# Altium project RCJ_OnStage2024_FC.PrjPcb
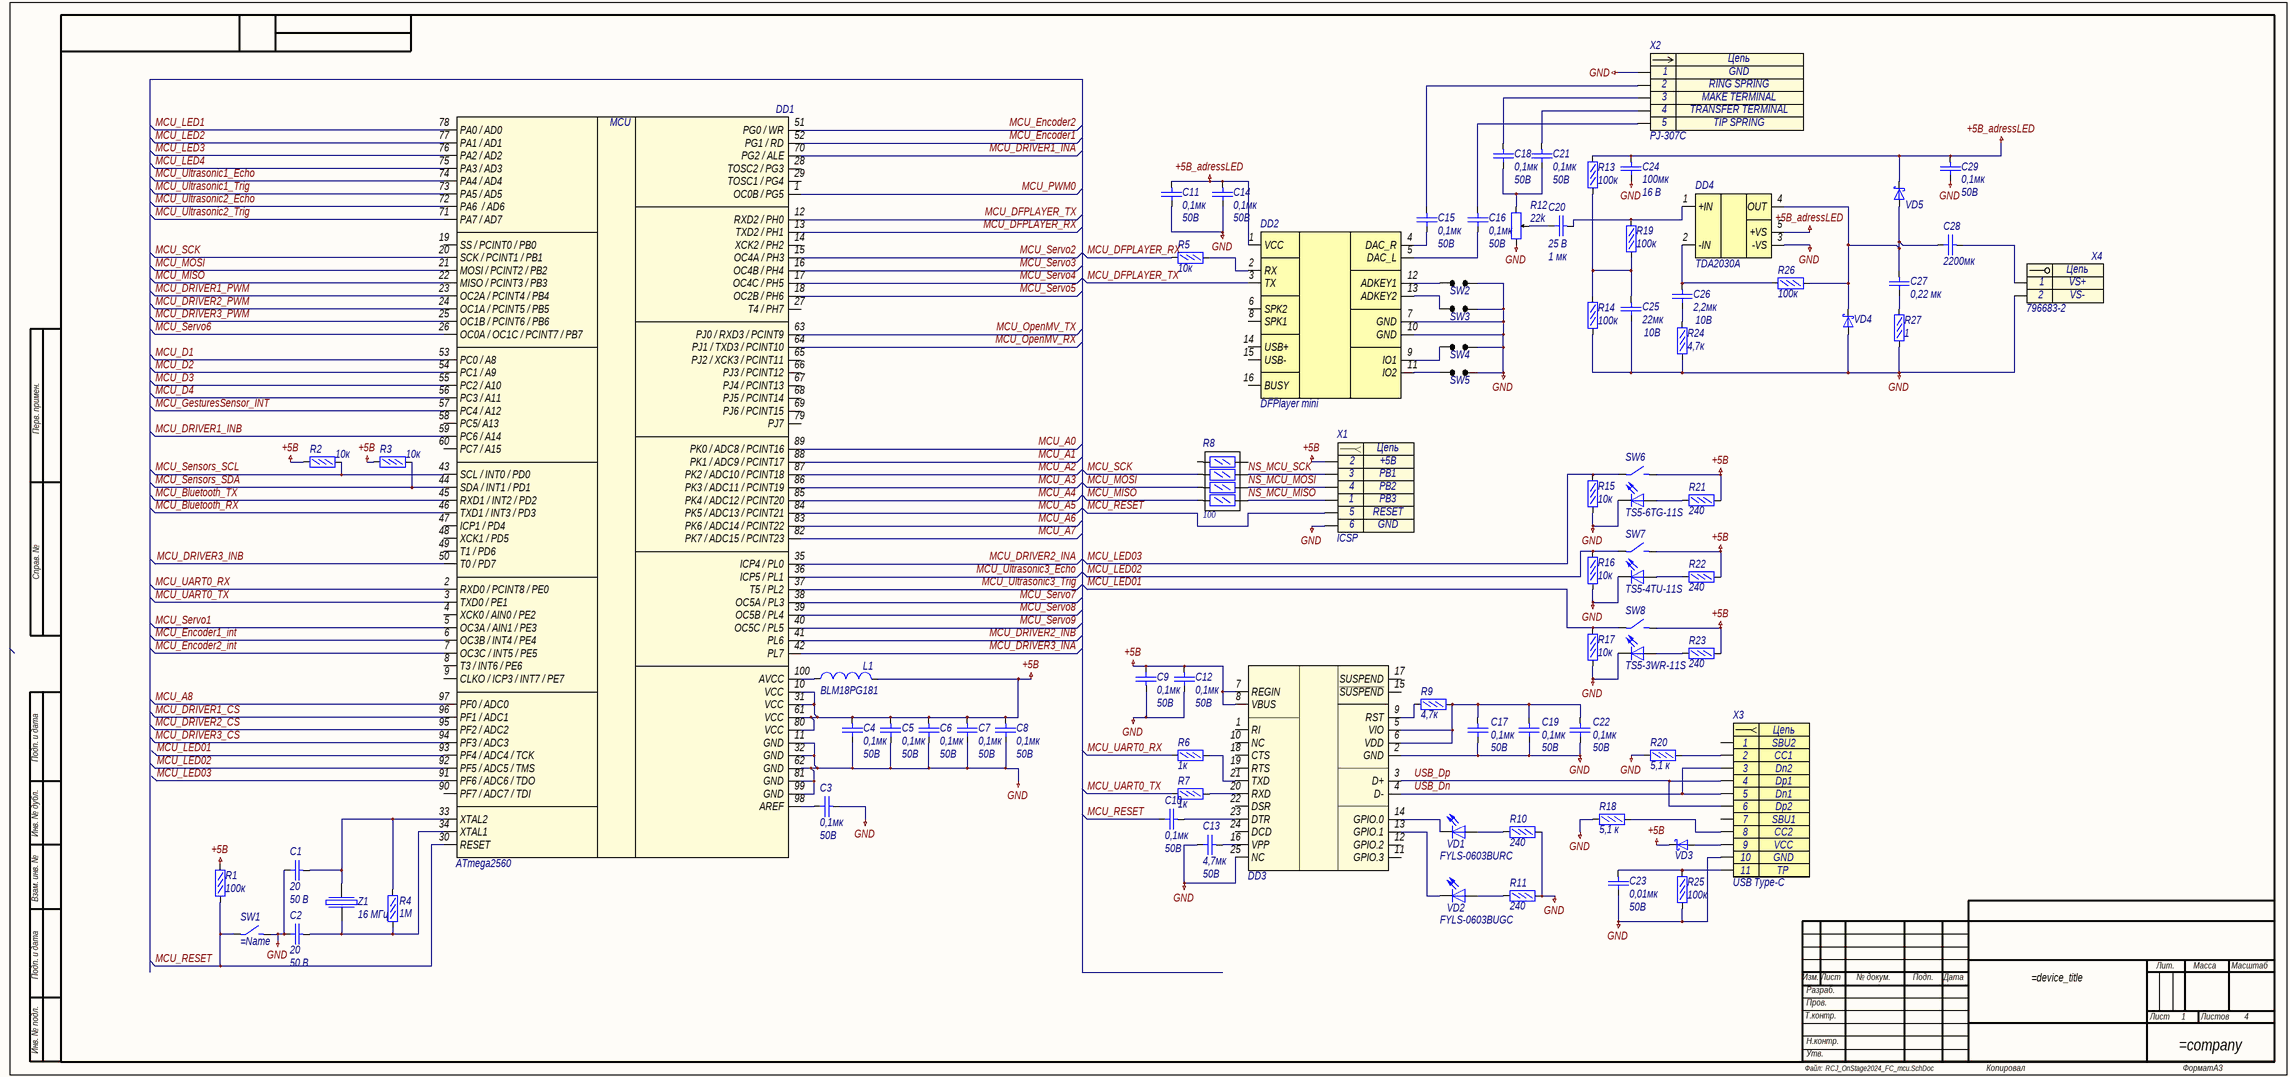
[diagram p0: RCJ_OnStage2024_FC_mcu.SchDoc]
4 sheets, 228 parts. Net scope: global (net labels, ports and power ports of the same name join across sheets).
Board file: RCJ_OnStage2024_FC.PcbDoc
Sheets:
  RCJ_OnStage2024_FC_mcu.SchDoc
  RCJ_OnStage2024_FC_drivers.SchDoc
  RCJ_OnStage2024_FC_sensors.SchDoc
  RCJ_OnStage2024_FC_pwr.SchDoc

## Sheet RCJ_OnStage2024_FC_mcu.SchDoc
size 891 x 420 mm; SheetNumber: 1; SheetTotal: 4; SheetSize: А3

### Parts
C1  20  Voltage: 50 В  [C0603]
C2  20  Voltage: 50 В  [C0603]
C3  0,1мк  Voltage: 50В  [C0603]
C4  0,1мк  Voltage: 50В  [C0603]
C5  0,1мк  Voltage: 50В  [C0603]
C6  0,1мк  Voltage: 50В  [C0603]
C7  0,1мк  Voltage: 50В  [C0603]
C8  0,1мк  Voltage: 50В  [C0603]
C9  0,1мк  Voltage: 50В  [C0603]
C10  0,1мк  Voltage: 50В  [C0603]
C11  0,1мк  Voltage: 50В  [C0603]
C12  0,1мк  Voltage: 50В  [C0603]
C13  4,7мк  Voltage: 50В  [C1210]
C14  0,1мк  Voltage: 50В  [C0603]
C15  0,1мк  Voltage: 50В  [C0603]
C16  0,1мк  Voltage: 50В  [C0603]
C17  0,1мк  Voltage: 50В  [C0603]
C18  0,1мк  Voltage: 50В  [C0603]
C19  0,1мк  Voltage: 50В  [C0603]
C20  1 мк  [C0805]
C21  0,1мк  Voltage: 50В  [C0603]
C22  0,1мк  Voltage: 50В  [C0603]
C23  0,01мк  Voltage: 50В  [C0603]
C24  100мк  Voltage: 16 В  [C1210]
C25  22мк  Voltage: 10В  [C1210]
C26  2,2мк  Voltage: 10В  [C0603]
C27  0,22 мк  [C0805]
C28  2200мк  [C0603]
C29  0,1мк  Voltage: 50В  [C0603]
DD1  ATmega2560  [LQFP100]
DD2  DFPlayer mini  [MP3-TF-16P]
DD3  CP2104  [QFN-24]  (value not drawn)
DD4  TDA2030A  [TO-220-5B]
L1  BLM18PG181  [L0603]
R1  100к  [R0603]
R2  10к  [R0603]
R3  10к  [R0603]
R4  1М  [R0603]
R5  10к  [R0603]
R6  1к  [R0603]
R7  1к  [R0603]
R8  100  [R0603x4]
R9  4,7к  [R0603]
R10  240  [R0603]
R11  240  [R0603]
R12  22k  [RM065]
R13  100к  [R0603]
R14  100к  [R0603]
R15  10к  [R0603]
R16  10к  [R0603]
R17  10к  [R0603]
R18  5,1 к  [R0603]
R19  100к  [R0603]
R20  5,1 к  [R0603]
R21  240  [R0603]
R22  240  [R0603]
R23  240  [R0603]
R24  4,7к  [R0603]
R25  100к  [R0603]
R26  100к  [R0603]
R27  1  [R0603]
SW1  (no value)  [it-1187]
SW2  (no value)  [jumper]
SW3  (no value)  [jumper]
SW4  (no value)  [jumper]
SW5  (no value)  [jumper]
SW6  TS5-6TG-11S  [TS5]
SW7  TS5-4TU-11S  [TS5]
SW8  TS5-3WR-11S  [TS5]
VD1  FYLS-0603BURC  [LED0603_RED]
VD2  FYLS-0603BUGC  [LED0603_GREEN]
VD3  MBR140SFT1G  [SOD123]  (value not drawn)
VD4  MBR140SFT1G  [SOD123]  (value not drawn)
VD5  MBR140SFT1G  [SOD123]  (value not drawn)
X1  ICSP  [PLS-3x2]
X2  PJ-307C  [PJ-307C]
X3  USB Type-C  [USB4105-15-A-120]
X4  796683-2  [796683-2]
Z1  16 MГц  [QSMD3.2x2.5]

### Nets
+5В: C4.2 C5.2 C6.2 C7.2 C8.2 C9.1 C12.2 DD1.10(VCC) DD1.31(VCC) DD1.61(VCC) DD1.80(VCC) DD3.7(REGIN) DD3.8(VBUS) L1.2 R1.2 R2.1 R3.1 R21.2 R22.2 R23.2 SW6.4 SW7.4 SW8.4 VD3.1(K) X1.2
+5В_adressLED: C11.2 C14.2 C24.2 C29.2 DD2.1(VCC) DD4.5(+VS) R13.2 VD5.1(K)
GND: C1.1 C2.1 C3.2 C4.1 C5.1 C6.1 C7.1 C8.1 C9.2 C11.1 C12.1 C13.1 C14.1 C17.1 C19.1 C22.1 C23.1 C24.1 C25.1 C29.1 DD1.11(GND) DD1.32(GND) DD1.62(GND) DD1.81(GND) DD1.99(GND) DD2.7(GND) DD2.10(GND) DD3.2(GND) DD3.25(NC) DD4.3(-VS) R10.2 R11.2 R12.2 R14.1 R15.1 R16.1 R17.1 R18.1 R20.1 R24.1 R25.1 R27.1 SW1.2 SW2.2 SW3.2 SW4.2 SW5.2 SW6.5 SW7.5 SW8.5 VD4.2(A) X1.6 X2.1 X3.10(VCC) X4.2
MCU_A0: DD1.89(PK0_/_ADC8_/_PCINT16)
MCU_A1: DD1.88(PK1_/_ADC9_/_PCINT17)
MCU_A2: DD1.87(PK2_/_ADC10_/_PCINT18)
MCU_A3: DD1.86(PK3_/_ADC11_/_PCINT19)
MCU_A4: DD1.85(PK4_/_ADC12_/_PCINT20)
MCU_A5: DD1.84(PK5_/_ADC13_/_PCINT21)
MCU_A6: DD1.83(PK6_/_ADC14_/_PCINT22)
MCU_A7: DD1.82(PK7_/_ADC15_/_PCINT23)
MCU_A8: DD1.97(PF0_/_ADC0)
MCU_Bluetooth_RX: DD1.46(TXD1_/_INT3_/_PD3)
MCU_Bluetooth_TX: DD1.45(RXD1_/_INT2_/_PD2)
MCU_D1: DD1.53(PC0_/_A8)
MCU_D2: DD1.54(PC1_/_A9)
MCU_D3: DD1.55(PC2_/_A10)
MCU_D4: DD1.56(PC3_/_A11)
MCU_DFPLAYER_RX: DD1.13(TXD2_/_PH1) R5.1
MCU_DFPLAYER_TX: DD1.12(RXD2_/_PH0) DD2.3(TX)
MCU_DRIVER1_CS: DD1.96(PF1_/_ADC1)
MCU_DRIVER1_INA: DD1.70(PG2_/_ALE)
MCU_DRIVER1_INB: DD1.59(PC6_/_A14)
MCU_DRIVER1_PWM: DD1.23(OC2A_/_PCINT4_/_PB4)
MCU_DRIVER2_CS: DD1.95(PF2_/_ADC2)
MCU_DRIVER2_INA: DD1.35(ICP4_/_PL0)
MCU_DRIVER2_INB: DD1.41(PL6)
MCU_DRIVER2_PWM: DD1.24(OC1A_/_PCINT5_/_PB5)
MCU_DRIVER3_CS: DD1.94(PF3_/_ADC3)
MCU_DRIVER3_INA: DD1.42(PL7)
MCU_DRIVER3_INB: DD1.50(T0_/_PD7)
MCU_DRIVER3_PWM: DD1.25(OC1B_/_PCINT6_/_PB6)
MCU_Encoder1: DD1.52(PG1_/_RD)
MCU_Encoder1_int: DD1.6(OC3B_/_INT4_/_PE4)
MCU_Encoder2: DD1.51(PG0_/_WR)
MCU_Encoder2_int: DD1.7(OC3C_/_INT5_/_PE5)
MCU_GesturesSensor_INT: DD1.57(PC4_/_A12)
MCU_LED1: DD1.78(PA0_/_AD0)
MCU_LED01: DD1.93(PF4_/_ADC4_/_TCK) R17.2 SW8.1
MCU_LED2: DD1.77(PA1_/_AD1)
MCU_LED02: DD1.92(PF5_/_ADC5_/_TMS) R16.2 SW7.1
MCU_LED3: DD1.76(PA2_/_AD2)
MCU_LED03: DD1.91(PF6_/_ADC6_/_TDO) R15.2 SW6.1
MCU_LED4: DD1.75(PA3_/_AD3)
MCU_MISO: DD1.22(MISO_/_PCINT3_/_PB3) R8.3
MCU_MOSI: DD1.21(MOSI_/_PCINT2_/_PB2) R8.5
MCU_OpenMV_RX: DD1.64(PJ1_/_TXD3_/_PCINT10)
MCU_OpenMV_TX: DD1.63(PJ0_/_RXD3_/_PCINT9)
MCU_PWM0: DD1.1(OC0B_/_PG5)
MCU_RESET: C10.1 DD1.30(RESET) R1.1 SW1.1 X1.5
MCU_SCK: DD1.20(SCK_/_PCINT1_/_PB1) R8.7
MCU_Sensors_SCL: DD1.43(SCL_/_INT0_/_PD0) R2.2
MCU_Sensors_SDA: DD1.44(SDA_/_INT1_/_PD1) R3.2
MCU_Servo1: DD1.5(OC3A_/_AIN1_/_PE3)
MCU_Servo2: DD1.15(OC4A_/_PH3)
MCU_Servo3: DD1.16(OC4B_/_PH4)
MCU_Servo4: DD1.17(OC4C_/_PH5)
MCU_Servo5: DD1.18(OC2B_/_PH6)
MCU_Servo6: DD1.26(OC0A_/_OC1C_/_PCINT7_/_PB7)
MCU_Servo7: DD1.38(OC5A_/_PL3)
MCU_Servo8: DD1.39(OC5B_/_PL4)
MCU_Servo9: DD1.40(OC5C_/_PL5)
MCU_UART0_RX: DD1.2(RXD0_/_PCINT8_/_PE0) R6.1
MCU_UART0_TX: DD1.3(TXD0_/_PE1) R7.1
MCU_Ultrasonic1_Echo: DD1.74(PA4_/_AD4)
MCU_Ultrasonic1_Trig: DD1.73(PA5_/_AD5)
MCU_Ultrasonic2_Echo: DD1.72(PA6__/_AD6)
MCU_Ultrasonic2_Trig: DD1.71(PA7_/_AD7)
MCU_Ultrasonic3_Echo: DD1.36(ICP5_/_PL1)
MCU_Ultrasonic3_Trig: DD1.37(T5_/_PL2)
NS_MCU_MISO: R8.4 X1.1
NS_MCU_MOSI: R8.6 X1.4
NS_MCU_SCK: R8.8 X1.3
USB_Dn: DD3.4(D-) X3.3(B7) X3.5(A7)
USB_Dp: DD3.3(D+) X3.4(A6) X3.6(B6)
NetC1_2: C1.2 DD1.33(XTAL2) R4.2 Z1.2
NetC2_2: C2.2 DD1.34(XTAL1) R4.1 Z1.1
NetC3_1: C3.1 DD1.98(AREF)
NetC10_2: C10.2 DD3.23(DTR)
NetC13_2: C13.2 DD3.16(VPP)
NetC15_1: C15.1 DD2.4(DAC_R)
NetC15_2: C15.2 X2.2
NetC16_1: C16.1 DD2.5(DAC_L)
NetC16_2: C16.2 X2.5
NetC17_2: C17.2 C19.2 C22.2 DD3.5(VIO) DD3.6(VDD) R9.2
NetC18_1: C18.1 C21.1 R12.1
NetC18_2: C18.2 X2.3
NetC20_1: C20.1 R12.3
NetC20_2: C20.2 DD4.1(+IN) R19.2
NetC21_2: C21.2 X2.4
NetC23_2: C23.2 R25.2 X3.TP
NetC25_2: C25.2 R13.1 R14.2 R19.1
NetC26_1: C26.1 R24.2
NetC26_2: C26.2 DD4.2(-IN) R26.1
NetC27_1: C27.1 R27.2
NetC27_2: C27.2 C28.1 DD4.4(OUT) R26.2 VD4.1(K) VD5.2(A)
NetC28_2: C28.2 X4.1
NetDD1_100: DD1.100(AVCC) L1.1
NetDD2_2: DD2.2(RX) R5.2
NetDD2_9: DD2.9(IO1) SW4.1
NetDD2_11: DD2.11(IO2) SW5.1
NetDD2_12: DD2.12(ADKEY1) SW2.1
NetDD2_13: DD2.13(ADKEY2) SW3.1
NetDD3_9: DD3.9(RST) R9.1
NetDD3_13: DD3.13(GPIO.1) VD2.1(K)
NetDD3_14: DD3.14(GPIO.0) VD1.1(K)
NetDD3_20: DD3.20(RXD) R7.2
NetDD3_21: DD3.21(TXD) R6.2
NetR10_1: R10.1 VD1.2(A)
NetR11_1: R11.1 VD2.2(A)
NetR18_2: R18.2 X3.8(B5)
NetR20_2: R20.2 X3.2(A5)
NetR21_1: R21.1 SW6.6
NetR22_1: R22.1 SW7.6
NetR23_1: R23.1 SW8.6
NetVD3_2: VD3.2(A) X3.9(GND)

Not connected (* = marked no-connect by the designer): DD1 4(XCK0_/_AIN0_/_PE2) 8(T3_/_INT6_/_PE6) 9(CLKO_/_ICP3_/_INT7_/_PE7) 14(XCK2_/_PH2) 19(SS_/_PCINT0_/_PB0) 27(T4_/_PH7) 28(TOSC2_/_PG3) 29(TOSC1_/_PG4) 47(ICP1_/_PD4) 48(XCK1_/_PD5) 49(T1_/_PD6) 58(PC5/_A13) 60(PC7_/_A15) 65(PJ2_/_XCK3_/_PCINT11) 66(PJ3_/_PCINT12) 67(PJ4_/_PCINT13) 68(PJ5_/_PCINT14) 69(PJ6_/_PCINT15) 79(PJ7) 90(PF7_/_ADC7_/_TDI); DD2 6(SPK2) 8(SPK1) 14(USB+) 15(USB-) 16(BUSY); DD3 1(RI) 10(NC) 11(GPIO.3) 12(GPIO.2) 15(~{SUSPEND}) 17(SUSPEND) 18(CTS) 19(RTS) 22(DSR) 24(DCD); R8 1 2; X3 1(B8) 7(A8)

### Notes on the sheet
- Перв. примен.
- Справ. №
- Подп. и дата
- Инв. № дубл.
- Взам. инв. №
- Изм.
- Лист
- № докум.
- Подп.
- Дата
- Лит.
- Масса
- Масштаб
- Т.контр.
- Пров.
- Разраб.
- Листов
- Инв. № подл.
- Н.контр.
- Файл:
- Утв.
- Копировал
- Формат
- (in symbol 796683-2) Цепь
- (in symbol ATmega2560) MCU
- (in symbol CC0805KKX7R8BB105) 25 В
- (in symbol ICSP) Цепь
- (in symbol PJ-307C) Цепь
- (in symbol USB4105) Цепь; 11

### Library data of the parts
C1 C2 = CC0603JRNPO9BN200: Конденсатор керамический 20пФ 50В; Value: 20
C3-C12 C14-C19 C21 C22 C29 = GRM188R71H104KA93D: Конденсатор кер. 0,1мкФ 50В X7R; Manufacturer: Murata; Name: GRM188R71H104KA93D; TKE: X7R; Value: 0,1мк
C13 = GRM32ER71H475KA88L: Конденсатор кер. 4,7мкФ 50В X7R; Manufacturer: Murata; Name: GRM32ER71H475KA88L; TKE: X7R; Value: 4,7мк
C20 = CC0805KKX7R8BB105: Конденсатор кер. 1мкФ 25В; Value: 1 мк
C23 = GRM188R71H103K: Конденсатор кер. 0,01мкФ 50В X7R; Manufacturer: Murata; TKE: X7R; Name: GRM188R71H103K; Value: 0,01мк
C24 = CC1210MKX5R7BB107: Конденсатор керамический 100мкФ 16В; Value: 100мк
C25 = GRM32ER61A226K: Конденсатор кер. 22мкФ 10В X5R; Manufacturer: Murata; Name: GRM32ER61A226K; TKE: X5R; Value: 22мк
C26 = GRM188R61A225K: Конденсатор кер. 2,2мкФ 10В X5R; Manufacturer: Murata; Name: GRM188R61A225K; TKE: X5R; Value: 2,2мк
C27 = CC0805JKX7R9BB224: Конденсатор кер. 0,22мкФ 50В; Value: 0,22 мк; Voltage: 50В
C28 = C0603: Конденсатор керамический 0603; Name: -; Manufacturer: -; TKE: -; Value: 2200мк; Voltage: -
DD1 = ATmega2560: Микроконтроллер; Name: ATmega2560
DD3 = CP2104: Преобразователь интерфейсов USB-UART; Name: CP2104
DD4 = TDA2030A: Усилитель звука; Name: TDA2030A
L1 = BLM18PG181: Ферритовая бусина; Manufacturer: Murata; Name: BLM18PG181
R1 R13 R14 R19 R25 R26 = RC0603FR-07100KL: Резистор 100кОм 0,063Вт 1%; Value: 100к
R2 R3 R5 R15-R17 = RC0603FR-0710KL: Резистор 10кОм 0,063Вт 1%; Manufacturer: YAGEO; Name: RC0603FR-0710KL; Tolerance: 1%; Value: 10к
R4 = RC0603FR-071ML: Резистор 1 МОм 0,063Вт 1%; Value: 1М
R6 R7 = RC0603FR-071KL: Резистор 1кОм 0,063Вт 1%; Manufacturer: YAGEO; Name: RC0603FR-071KL; Tolerance: 1%; Value: 1к
R8 = Резисторная сборка х4 0,125: Резисторы  0,125Вт; Value: 100
R9 R24 = RC0603FR-074K7L: Резистор 4,7кОм 0,063Вт 1%; Manufacturer: YAGEO; Name: RC0603FR-074K7L; Tolerance: 1%; Value: 4,7к
R10 R11 R21-R23 = RC0603FR-07240RL: Резистор 240Ом 0,063Вт 1%; Manufacturer: YAGEO; Name: RC0603FR-07240RL; Tolerance: 1%; Value: 240
R12 = RM065: Резистор переменный, 0.125 Вт, 20 кОм, 3-20, 20%; Value: 22k
R18 R20 = RC0603JR-075K1L: Резистор 5,1 кОм; Value: 5,1 к
R27 = RC0603FR-071RL: Резистор 1Ом 0,063Вт 1%; Manufacturer: YAGEO; Name: RC0603FR-071RL; Tolerance: 1%; Value: 1
SW1 = button
SW2-SW5 = Jumper: Запаиваемая перемычка
SW6 = TS5-6TG-11S: Миниатюрная кнопка с LED-подсветкой (зеленая); Name: TS5-6TG-11S
SW7 = TS5-4TU-11S: Миниатюрная кнопка с LED-подсветкой (синяя); Name: TS5-4TU-11S
SW8 = TS5-3WR-11S: Миниатюрная кнопка с LED-подсветкой (красная); Name: TS5-3WR-11S
VD1 VD2 = LED: Светодиод
  VD1: Name: FYLS-0603BURC
  VD2: Name: FYLS-0603BUGC
VD3-VD5 = MBR140SFT1G: Диод Шоттки 40В 1А; Name: MBR140SFT1G
X1 = ICSP: Разъем для программатора; Contact_1: +5B; Contact_2: PB1; Contact_3: PB2; Contact_4: PB3; Contact_5: RESET; Contact_6: GND; Name: ICSP
X2 = PJ-307C: Φ3.5mm, 3 poles, Audio Jack; Contact_1: GND; Contact_2: RING SPRING; Contact_3: MAKE TERMINAL; Contact_4: TRANSFER TERMINAL; Contact_5: TIP SPRING; Name: PJ-307C
X3 = USB4105: USB Type-C USB4105-GF-A / GCT; Contact_1: SBU2; Contact_2: CC1; Contact_3: Dn2; Contact_4: Dp1; Contact_5: Dn1; Contact_6: Dp2; Contact_7: SBU1; Contact_8: CC2; Contact_9: VCC; Contact_10: GND; Name: USB Type-C
X4 = 796683-2: Винтовой клеммник (наборный 2х2); Contact_1: VS+; Contact_2: VS-; Name: 796683-2
Z1 = QuartzCystal: Кварцевый резонатор; Value: 16 MГц
DD2 = DFPlayer mini: Name: DFPlayer mini

## Sheet RCJ_OnStage2024_FC_drivers.SchDoc
size 891 x 420 mm; SheetNumber: 2; SheetTotal: 4; SheetSize: А3
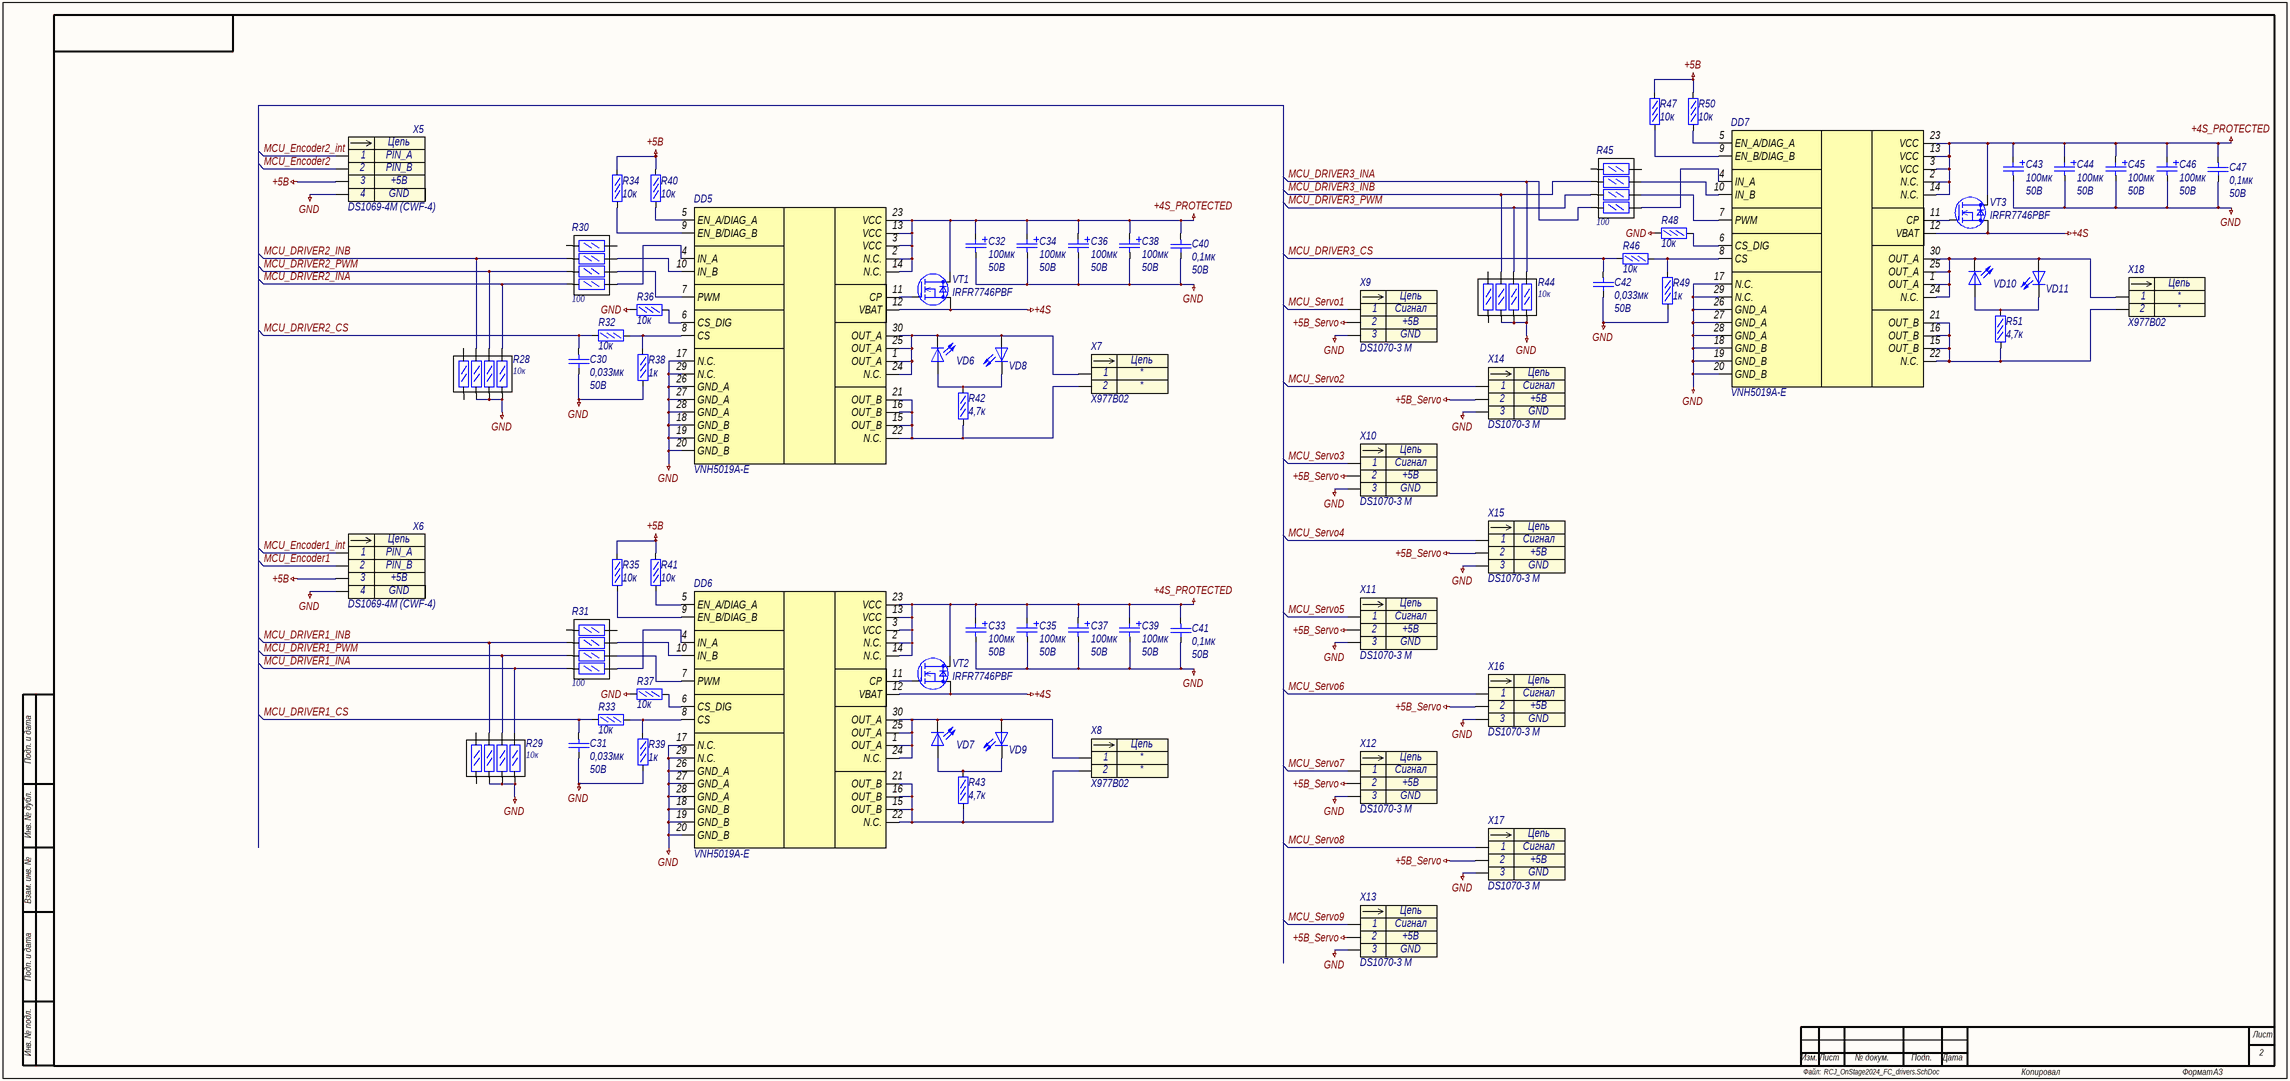
[diagram p1: RCJ_OnStage2024_FC_drivers.SchDoc]

### Parts
C30  0,033мк  Voltage: 50В  [C1206]
C31  0,033мк  Voltage: 50В  [C1206]
C32  100мк  Voltage: 50В  [CAPALUM_8x11.5_V]
C33  100мк  Voltage: 50В  [CAPALUM_8x11.5_V]
C34  100мк  Voltage: 50В  [CAPALUM_8x11.5_V]
C35  100мк  Voltage: 50В  [CAPALUM_8x11.5_V]
C36  100мк  Voltage: 50В  [CAPALUM_8x11.5_V]
C37  100мк  Voltage: 50В  [CAPALUM_8x11.5_V]
C38  100мк  Voltage: 50В  [CAPALUM_8x11.5_V]
C39  100мк  Voltage: 50В  [CAPALUM_8x11.5_V]
C40  0,1мк  Voltage: 50В  [C0603]
C41  0,1мк  Voltage: 50В  [C0603]
C42  0,033мк  Voltage: 50В  [C1206]
C43  100мк  Voltage: 50В  [CAPALUM_8x11.5_V]
C44  100мк  Voltage: 50В  [CAPALUM_8x11.5_V]
C45  100мк  Voltage: 50В  [CAPALUM_8x11.5_V]
C46  100мк  Voltage: 50В  [CAPALUM_8x11.5_V]
C47  0,1мк  Voltage: 50В  [C0603]
DD5  VNH5019A-E  [SO-30]
DD6  VNH5019A-E  [SO-30]
DD7  VNH5019A-E  [SO-30]
R28  10к  [R0603x4]
R29  10к  [R0603x4]
R30  100  [R0603x4]
R31  100  [R0603x4]
R32  10к  [R0603]
R33  10к  [R0603]
R34  10к  [R0603]
R35  10к  [R0603]
R36  10к  [R0603]
R37  10к  [R0603]
R38  1к  [R0603]
R39  1к  [R0603]
R40  10к  [R0603]
R41  10к  [R0603]
R42  4,7к  [R0603]
R43  4,7к  [R0603]
R44  10к  [R0603x4]
R45  100  [R0603x4]
R46  10к  [R0603]
R47  10к  [R0603]
R48  10к  [R0603]
R49  1к  [R0603]
R50  10к  [R0603]
R51  4,7к  [R0603]
VD6  (no value)  [LED0603_RED]
VD7  (no value)  [LED0603_RED]
VD8  (no value)  [LED0603_GREEN]
VD9  (no value)  [LED0603_GREEN]
VD10  (no value)  [LED0603_RED]
VD11  (no value)  [LED0603_GREEN]
VT1  IRFR7746PBF  [D-PAK]
VT2  IRFR7746PBF  [D-PAK]
VT3  IRFR7746PBF  [D-PAK]
X5  DS1069-4M (CWF-4)  [CWF-4]
X6  DS1069-4M (CWF-4)  [CWF-4]
X7  X977B02  [DG25C-B-02P]
X8  X977B02  [DG25C-B-02P]
X9  DS1070-3 M  [DS1070-3]
X10  DS1070-3 M  [DS1070-3]
X11  DS1070-3 M  [DS1070-3]
X12  DS1070-3 M  [DS1070-3]
X13  DS1070-3 M  [DS1070-3]
X14  DS1070-3 M  [DS1070-3]
X15  DS1070-3 M  [DS1070-3]
X16  DS1070-3 M  [DS1070-3]
X17  DS1070-3 M  [DS1070-3]
X18  X977B02  [DG25C-B-02P]

### Nets
+4S: DD5.12(VBAT) DD6.12(VBAT) DD7.12(VBAT) VT1.3(S) VT2.3(S) VT3.3(S)
+4S_PROTECTED: C32.1 C33.1 C34.1 C35.1 C36.1 C37.1 C38.1 C39.1 C40.2 C41.2 C43.1 C44.1 C45.1 C46.1 C47.2 DD5.2(N.C.) DD5.3(VCC) DD5.13(VCC) DD5.14(N.C.) DD5.23(VCC) DD6.2(N.C.) DD6.3(VCC) DD6.13(VCC) DD6.14(N.C.) DD6.23(VCC) DD7.2(N.C.) DD7.3(VCC) DD7.13(VCC) DD7.14(N.C.) DD7.23(VCC) VT1.2(D) VT2.2(D) VT3.2(D)
+5В: R34.2 R35.2 R40.2 R41.2 R47.2 R50.2 X5.3 X6.3
+5В_Servo: X9.2 X10.2 X11.2 X12.2 X13.2 X14.2 X15.2 X16.2 X17.2
GND: C30.1 C31.1 C32.2 C33.2 C34.2 C35.2 C36.2 C37.2 C38.2 C39.2 C40.1 C41.1 C42.1 C43.2 C44.2 C45.2 C46.2 C47.1 DD5.17(N.C.) DD5.18(GND_B) DD5.19(GND_B) DD5.20(GND_B) DD5.26(GND_A) DD5.27(GND_A) DD5.28(GND_A) DD5.29(N.C.) DD6.17(N.C.) DD6.18(GND_B) DD6.19(GND_B) DD6.20(GND_B) DD6.26(GND_A) DD6.27(GND_A) DD6.28(GND_A) DD6.29(N.C.) DD7.17(N.C.) DD7.18(GND_B) DD7.19(GND_B) DD7.20(GND_B) DD7.26(GND_A) DD7.27(GND_A) DD7.28(GND_A) DD7.29(N.C.) R28.3 R28.5 R28.7 R29.3 R29.5 R29.7 R36.1 R37.1 R38.1 R39.1 R44.3 R44.5 R44.7 R48.1 R49.1 X5.4 X6.4 X9.3 X10.3 X11.3 X12.3 X13.3 X14.3 X15.3 X16.3 X17.3
MCU_DRIVER1_CS: C31.2 R33.1
MCU_DRIVER1_INA: R29.8 R31.7
MCU_DRIVER1_INB: R29.4 R31.3
MCU_DRIVER1_PWM: R29.6 R31.5
MCU_DRIVER2_CS: C30.2 R32.1
MCU_DRIVER2_INA: R28.8 R30.7
MCU_DRIVER2_INB: R28.4 R30.3
MCU_DRIVER2_PWM: R28.6 R30.5
MCU_DRIVER3_CS: C42.2 R46.1
MCU_DRIVER3_INA: R44.8 R45.7
MCU_DRIVER3_INB: R44.4 R45.3
MCU_DRIVER3_PWM: R44.6 R45.5
MCU_Encoder1: X6.2
MCU_Encoder1_int: X6.1
MCU_Encoder2: X5.2
MCU_Encoder2_int: X5.1
MCU_Servo1: X9.1
MCU_Servo2: X14.1
MCU_Servo3: X10.1
MCU_Servo4: X15.1
MCU_Servo5: X11.1
MCU_Servo6: X16.1
MCU_Servo7: X12.1
MCU_Servo8: X17.1
MCU_Servo9: X13.1
NetDD5_1: DD5.1(OUT_A) DD5.24(N.C.) DD5.25(OUT_A) DD5.30(OUT_A) VD6.1(K) VD8.2(A) X7.1
NetDD5_4: DD5.4(IN_A) R30.8
NetDD5_5: DD5.5(EN_A/DIAG_A) R40.1
NetDD5_6: DD5.6(CS_DIG) R36.2
NetDD5_7: DD5.7(PWM) R30.6
NetDD5_8: DD5.8(CS) R32.2 R38.2
NetDD5_9: DD5.9(EN_B/DIAG_B) R34.1
NetDD5_10: DD5.10(IN_B) R30.4
NetDD5_11: DD5.11(CP) VT1.1(G)
NetDD5_15: DD5.15(OUT_B) DD5.16(OUT_B) DD5.21(OUT_B) DD5.22(N.C.) R42.2 X7.2
NetDD6_1: DD6.1(OUT_A) DD6.24(N.C.) DD6.25(OUT_A) DD6.30(OUT_A) VD7.1(K) VD9.2(A) X8.1
NetDD6_4: DD6.4(IN_A) R31.8
NetDD6_5: DD6.5(EN_A/DIAG_A) R41.1
NetDD6_6: DD6.6(CS_DIG) R37.2
NetDD6_7: DD6.7(PWM) R31.6
NetDD6_8: DD6.8(CS) R33.2 R39.2
NetDD6_9: DD6.9(EN_B/DIAG_B) R35.1
NetDD6_10: DD6.10(IN_B) R31.4
NetDD6_11: DD6.11(CP) VT2.1(G)
NetDD6_15: DD6.15(OUT_B) DD6.16(OUT_B) DD6.21(OUT_B) DD6.22(N.C.) R43.2 X8.2
NetDD7_1: DD7.1(OUT_A) DD7.24(N.C.) DD7.25(OUT_A) DD7.30(OUT_A) VD10.1(K) VD11.2(A) X18.1
NetDD7_4: DD7.4(IN_A) R45.8
NetDD7_5: DD7.5(EN_A/DIAG_A) R50.1
NetDD7_6: DD7.6(CS_DIG) R48.2
NetDD7_7: DD7.7(PWM) R45.6
NetDD7_8: DD7.8(CS) R46.2 R49.2
NetDD7_9: DD7.9(EN_B/DIAG_B) R47.1
NetDD7_10: DD7.10(IN_B) R45.4
NetDD7_11: DD7.11(CP) VT3.1(G)
NetDD7_15: DD7.15(OUT_B) DD7.16(OUT_B) DD7.21(OUT_B) DD7.22(N.C.) R51.2 X18.2
NetR42_1: R42.1 VD6.2(A) VD8.1(K)
NetR43_1: R43.1 VD7.2(A) VD9.1(K)
NetR51_1: R51.1 VD10.2(A) VD11.1(K)

Not connected (* = marked no-connect by the designer): R28 1 2; R29 1 2; R30 1 2; R31 1 2; R44 1 2; R45 1 2

### Notes on the sheet
- Подп. и дата
- Инв. № дубл.
- Взам. инв. №
- Инв. № подл.
- Лист
- Файл:
- Изм.
- № докум.
- Подп.
- Дата
- Копировал
- Формат
- (in symbol CWF-4) Цепь
- (in symbol WF-3) Цепь
- (in symbol X977B02) Цепь

### Library data of the parts
C30 C31 C42 = GRM3195C1H333J: Конденсатор кер. 0,033мкФ 50В NP0; Manufacturer: Murata; Name: GRM3195C1H333J; TKE: NP0; Value: 0,033мк
C32-C39 C43-C46 = B41858C6107M: Конденсатор эл.лит. алюм. 100мкФ 50В; Manufacturer: EPCOS; ESR: 0,6Ом; Name: B41858C6107; Value: 100мк
C40 C41 C47 = GRM188R71H104KA93D: as C3 on sheet RCJ_OnStage2024_FC_mcu; Name: GRM188R71H104KA93D; TKE: X7R; Value: 0,1мк
R28 R29 R44 = Резисторная сборка х4 0,125 10кОм: Резисторы  0,125Вт; Value: 10к
R30 R31 R45 = Резисторная сборка х4 0,125: Резисторы  0,125Вт; Value: 100
R32-R37 R40 R41 R46-R48 R50 = RC0603FR-0710KL: as R2 on sheet RCJ_OnStage2024_FC_mcu; Name: RC0603FR-0710KL; Tolerance: 1%; Value: 10к
R38 R39 R49 = RC0603FR-071KL: as R6 on sheet RCJ_OnStage2024_FC_mcu; Name: RC0603FR-071KL; Tolerance: 1%; Value: 1к
R42 R43 R51 = RC0603FR-074K7L: as R9 on sheet RCJ_OnStage2024_FC_mcu; Name: RC0603FR-074K7L; Tolerance: 1%; Value: 4,7к
VD6-VD11 = LED: Светодиод
VT1-VT3 = IRFR7746PBF: N-MOSFET 75В, 56А; Manufacturer: Internationa Rectifier; Name: IRFR7746PBF
X5 X6 = CWF-4: Разъем - 4 конт. прямая вилка на плату; Contact_1: PIN_A; Contact_2: PIN_B; Contact_3: +5В; Contact_4: GND; Name: DS1069-4M (CWF-4)
X7 X8 X18 = X977B02: Клеммник 2-контактный шаг 7.62мм; Name: X977B02; Contact_1: *; Contact_2: *
X9-X17 = WF-3: Вилка на плату 2.54мм открытая 3pin; Contact_1: Сигнал; Contact_2: +5В; Contact_3: GND; Name: DS1070-3 M
DD5-DD7 = VNH5019A-E: Name: VNH5019A-E

## Sheet RCJ_OnStage2024_FC_sensors.SchDoc
size 594 x 420 mm; SheetNumber: 3; SheetTotal: 4; SheetSize: А3
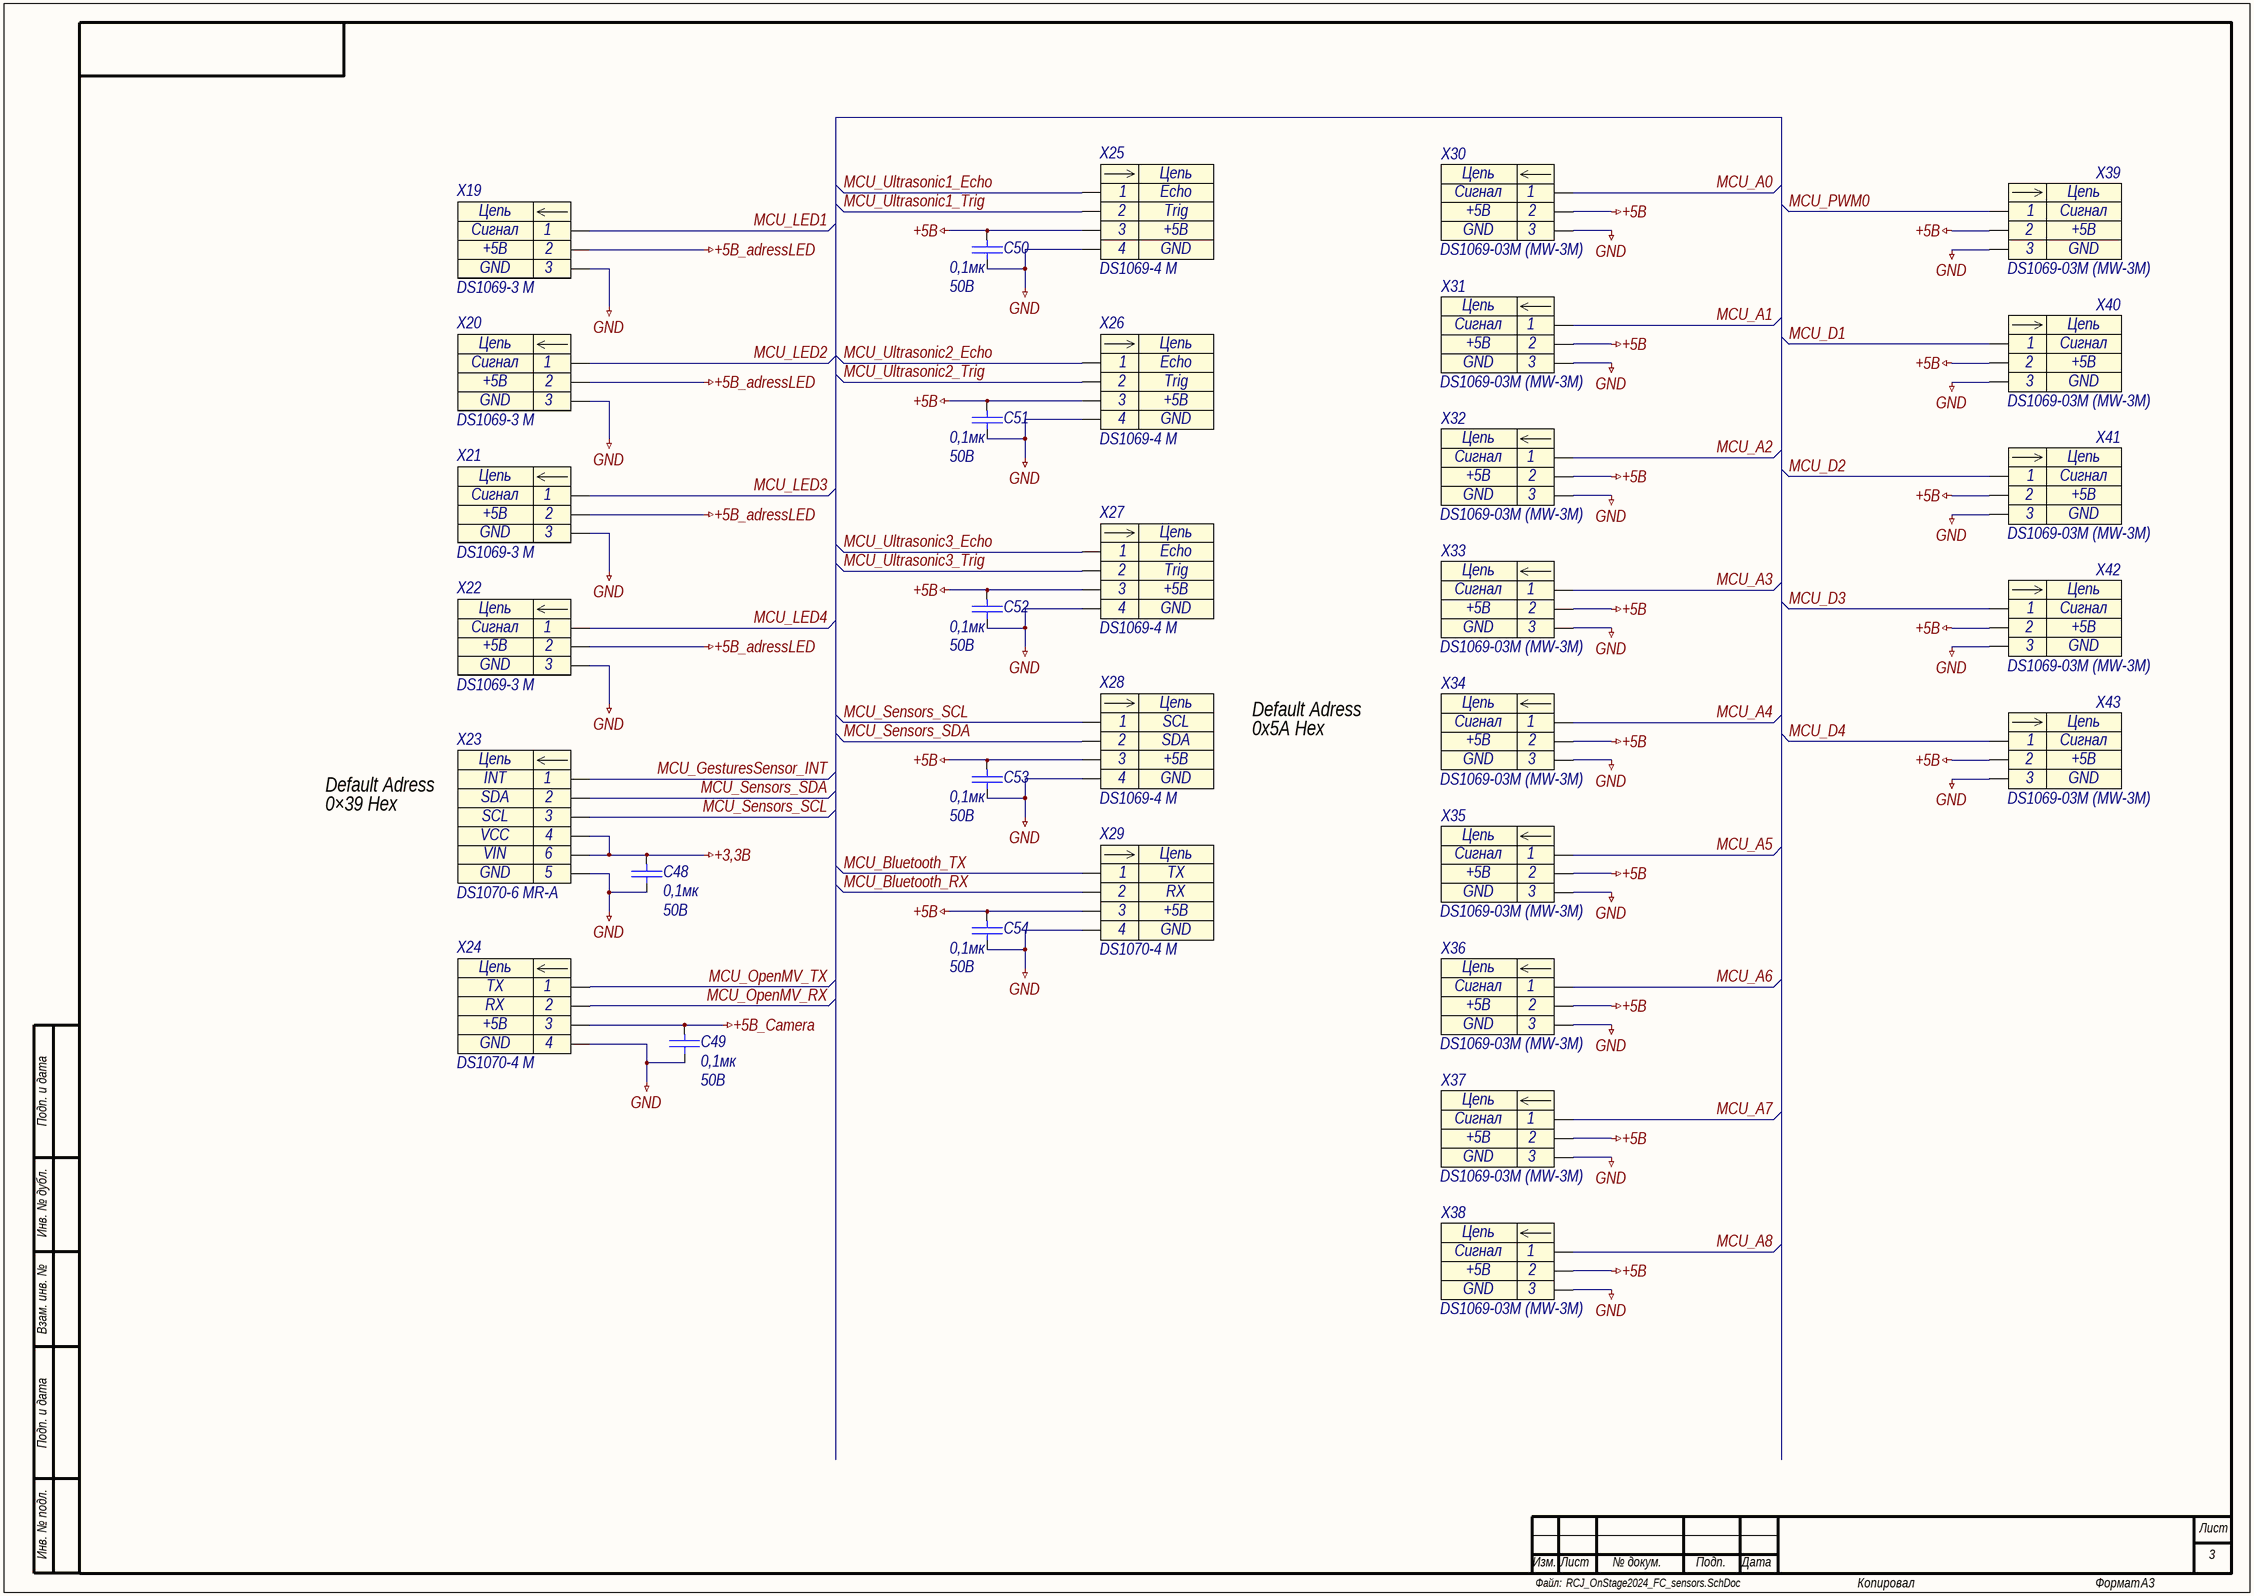
[diagram p2: RCJ_OnStage2024_FC_sensors.SchDoc]

### Parts
C48  0,1мк  Voltage: 50В  [C0603]
C49  0,1мк  Voltage: 50В  [C0603]
C50  0,1мк  Voltage: 50В  [C0603]
C51  0,1мк  Voltage: 50В  [C0603]
C52  0,1мк  Voltage: 50В  [C0603]
C53  0,1мк  Voltage: 50В  [C0603]
C54  0,1мк  Voltage: 50В  [C0603]
X19  DS1069-3 M  [DS1070-3]
X20  DS1069-3 M  [DS1070-3]
X21  DS1069-3 M  [DS1070-3]
X22  DS1069-3 M  [DS1070-3]
X23  DS1070-6 MR-A  [DS1070-6]
X24  DS1070-4 M  [DS1070-4]
X25  DS1069-4 M  [DS1069-4]
X26  DS1069-4 M  [DS1069-4]
X27  DS1069-4 M  [DS1069-4]
X28  DS1069-4 M  [DS1069-4]
X29  DS1070-4 M  [DS1070-4]
X30  DS1069-03M (MW-3M)  [PLS-3]
X31  DS1069-03M (MW-3M)  [PLS-3]
X32  DS1069-03M (MW-3M)  [PLS-3]
X33  DS1069-03M (MW-3M)  [PLS-3]
X34  DS1069-03M (MW-3M)  [PLS-3]
X35  DS1069-03M (MW-3M)  [PLS-3]
X36  DS1069-03M (MW-3M)  [PLS-3]
X37  DS1069-03M (MW-3M)  [PLS-3]
X38  DS1069-03M (MW-3M)  [PLS-3]
X39  DS1069-03M (MW-3M)  [PLS-3]
X40  DS1069-03M (MW-3M)  [PLS-3]
X41  DS1069-03M (MW-3M)  [PLS-3]
X42  DS1069-03M (MW-3M)  [PLS-3]
X43  DS1069-03M (MW-3M)  [PLS-3]

### Nets
+3,3В: C48.2 X23.4 X23.5
+5В: C50.2 C51.2 C52.2 C53.2 C54.2 X25.3 X26.3 X27.3 X28.3 X29.3 X30.2 X31.2 X32.2 X33.2 X34.2 X35.2 X36.2 X37.2 X38.2 X39.2 X40.2 X41.2 X42.2 X43.2
+5В_adressLED: X19.2 X20.2 X21.2 X22.2
+5В_Camera: C49.2 X24.3
GND: C48.1 C49.1 C50.1 C51.1 C52.1 C53.1 C54.1 X19.3 X20.3 X21.3 X22.3 X23.6 X24.4 X25.4 X26.4 X27.4 X28.4 X29.4 X30.3 X31.3 X32.3 X33.3 X34.3 X35.3 X36.3 X37.3 X38.3 X39.3 X40.3 X41.3 X42.3 X43.3
MCU_A0: X30.1
MCU_A1: X31.1
MCU_A2: X32.1
MCU_A3: X33.1
MCU_A4: X34.1
MCU_A5: X35.1
MCU_A6: X36.1
MCU_A7: X37.1
MCU_A8: X38.1
MCU_Bluetooth_RX: X29.2
MCU_Bluetooth_TX: X29.1
MCU_D1: X40.1
MCU_D2: X41.1
MCU_D3: X42.1
MCU_D4: X43.1
MCU_GesturesSensor_INT: X23.1
MCU_LED1: X19.1
MCU_LED2: X20.1
MCU_LED3: X21.1
MCU_LED4: X22.1
MCU_OpenMV_RX: X24.2
MCU_OpenMV_TX: X24.1
MCU_PWM0: X39.1
MCU_Sensors_SCL: X23.3 X28.1
MCU_Sensors_SDA: X23.2 X28.2
MCU_Ultrasonic1_Echo: X25.1
MCU_Ultrasonic1_Trig: X25.2
MCU_Ultrasonic2_Echo: X26.1
MCU_Ultrasonic2_Trig: X26.2
MCU_Ultrasonic3_Echo: X27.1
MCU_Ultrasonic3_Trig: X27.2

### Notes on the sheet
- 0x5A Hex
- Default Adress
- 0×39 Hex
- Подп. и дата
- Инв. № дубл.
- Взам. инв. №
- Инв. № подл.
- Лист
- Файл:
- Изм.
- № докум.
- Подп.
- Дата
- Копировал
- Формат
- (in symbol PLS-3) Цепь
- (in symbol WF-3) Цепь
- (in symbol WF-4) Цепь
- (in symbol WF-6) Цепь

### Library data of the parts
C48-C54 = GRM188R71H104KA93D: as C3 on sheet RCJ_OnStage2024_FC_mcu; Name: GRM188R71H104KA93D; TKE: X7R; Value: 0,1мк
X19-X22 = WF-3: Вилка на плату 2.5мм открытая 3pin; Contact_1: Сигнал; Contact_2: +5В; Contact_3: GND; Name: DS1069-3 M
X23 = WF-6: Вилка на плату 2.54мм 6pin угловая закрытая тип А; Contact_1: INT; Contact_2: SDA; Contact_3: SCL; Contact_4: VCC; Contact_5: VIN; Contact_6: GND; Name: DS1070-6 MR-A
X24 X29 = WF-4: Вилка на плату 2.54мм открытая 4pin; Contact_1: TX; Contact_2: RX; Contact_3: +5В; Contact_4: GND; Name: DS1070-4 M
X25-X27 = WF-4: Вилка на плату 2.5мм открытая 4pin; Contact_1: Echo; Contact_2: Trig; Contact_3: +5В; Contact_4: GND; Name: DS1069-4 M
X28 = WF-4: Вилка на плату 2.5мм открытая 4pin; Contact_1: SCL; Contact_2: SDA; Contact_3: +5В; Contact_4: GND; Name: DS1069-4 M
X30-X43 = PLS-3: Разъем - 3 конт. прямая вилка на плату; Contact_1: Сигнал; Contact_2: +5В; Contact_3: GND; Name: DS1069-03M (MW-3M)

## Sheet RCJ_OnStage2024_FC_pwr.SchDoc
size 594 x 420 mm; SheetNumber: 4; SheetTotal: 4; SheetSize: А3
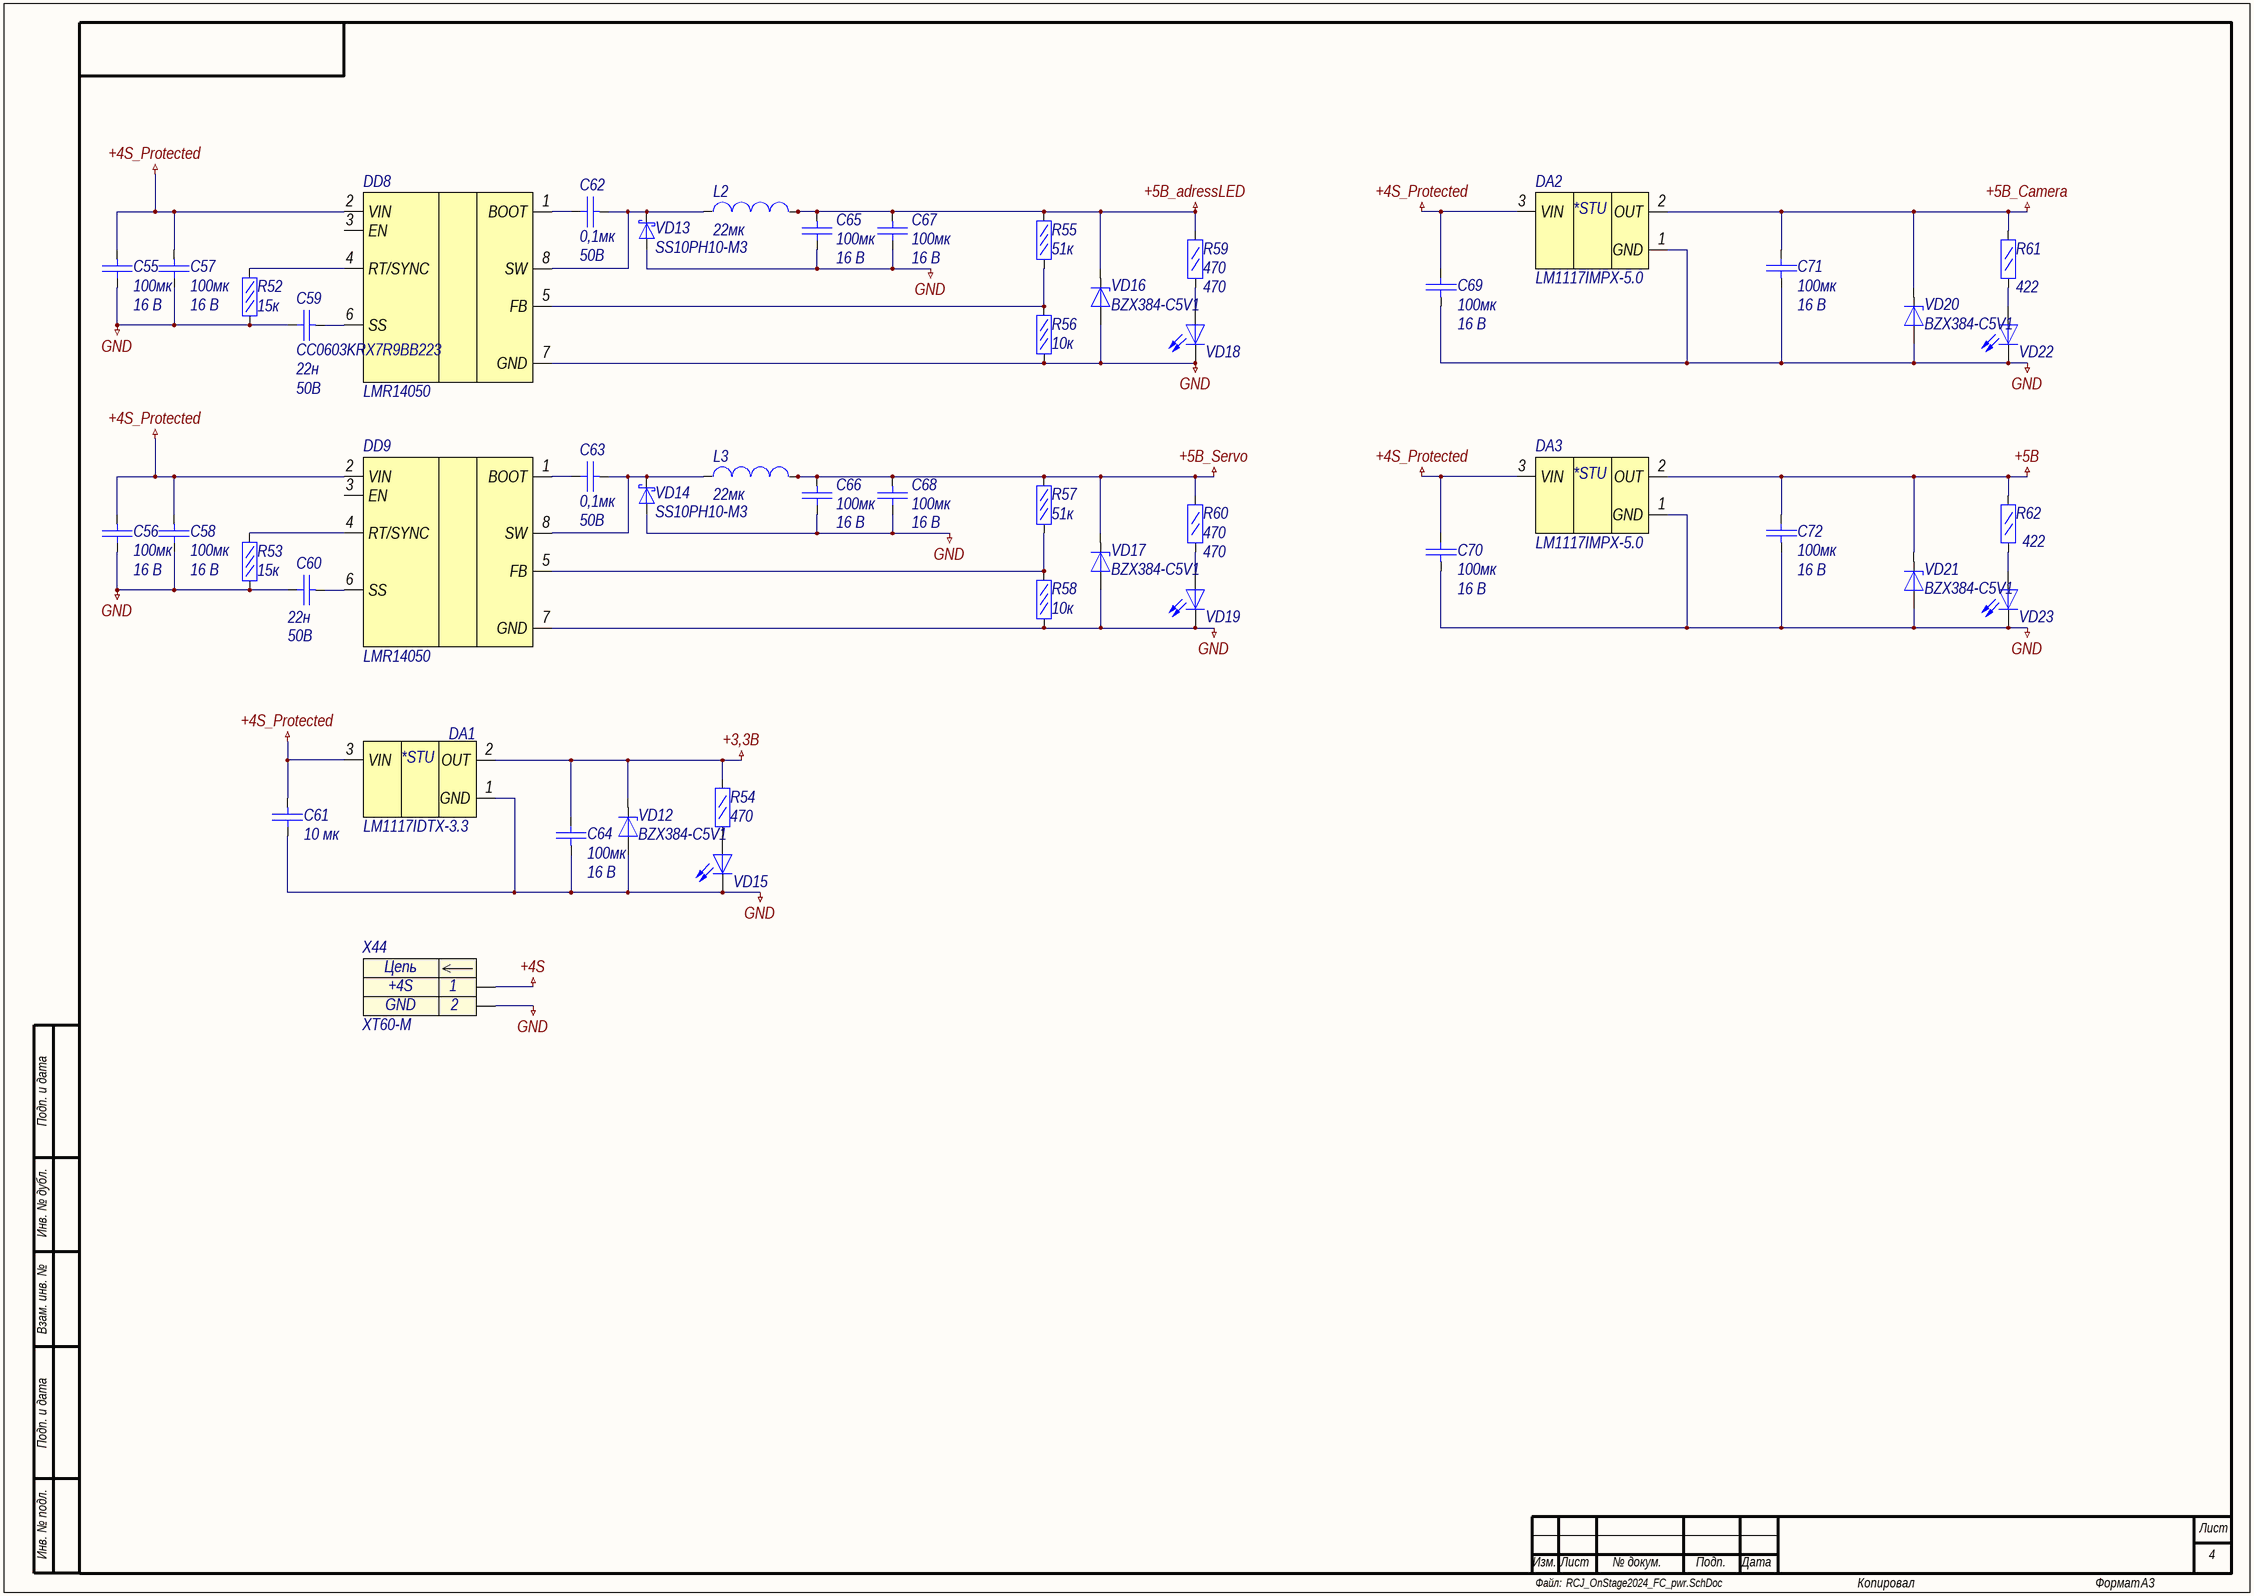
[diagram p3: RCJ_OnStage2024_FC_pwr.SchDoc]

### Parts
C55  100мк  Voltage: 16 В  [C1210]
C56  100мк  Voltage: 16 В  [C1210]
C57  100мк  Voltage: 16 В  [C1210]
C58  100мк  Voltage: 16 В  [C1210]
C59  CC0603KRX7R9BB223  value 22н  Voltage: 50В  [C0603]
C60  value 22н  Voltage: 50В  [C0603]  (hidden comment: CC0603KRX7R9BB223)
C61  10 мк  [C0805]
C62  0,1мк  Voltage: 50В  [C0603]
C63  0,1мк  Voltage: 50В  [C0603]
C64  100мк  Voltage: 16 В  [C1210]
C65  100мк  Voltage: 16 В  [C1210]
C66  100мк  Voltage: 16 В  [C1210]
C67  100мк  Voltage: 16 В  [C1210]
C68  100мк  Voltage: 16 В  [C1210]
C69  100мк  Voltage: 16 В  [C1210]
C70  100мк  Voltage: 16 В  [C1210]
C71  100мк  Voltage: 16 В  [C1210]
C72  100мк  Voltage: 16 В  [C1210]
DA1  LM1117IDTX-3.3  [D-PAK]
DA2  LM1117IMPX-5.0  [SOT-223]
DA3  LM1117IMPX-5.0  [SOT-223]
DD8  LMR14050  [SO-8]
DD9  LMR14050  [SO-8]
L2  value 22мк  [SRP1038A]  (hidden comment: SRP1038A-220M)
L3  value 22мк  [SRP1038A]  (hidden comment: SRP1038A-220M)
R52  15к  [R0603]
R53  15к  [R0603]
R54  470  [R0805]
R55  51к  [R0603]
R56  10к  [R0603]
R57  51к  [R0603]
R58  10к  [R0603]
R59  470  [R0805]
R60  470  [R0805]
R61  422  [R0805]
R62  422  [R0805]
VD12  BZX384-C5V1  [SOD323]
VD13  SS10PH10-M3  [TO277A]
VD14  SS10PH10-M3  [TO277A]
VD15  (no value)  [LED0603_RED]
VD16  BZX384-C5V1  [SOD323]
VD17  BZX384-C5V1  [SOD323]
VD18  (no value)  [LED0603_RED]
VD19  (no value)  [LED0603_RED]
VD20  BZX384-C5V1  [SOD323]
VD21  BZX384-C5V1  [SOD323]
VD22  (no value)  [LED0603_RED]
VD23  (no value)  [LED0603_RED]
X44  XT60-M  [XT60-M]

### Nets
+3,3В: C64.1 DA1.2(OUT) R54.2 VD12.2(K)
+4S: X44.1
+4S_PROTECTED: C55.2 C56.2 C57.2 C58.2 C61.2 C69.1 C70.1 DA1.3(VIN) DA2.3(VIN) DA3.3(VIN) DD8.2(VIN) DD9.2(VIN)
+5В: C72.1 DA3.2(OUT) R62.2 VD21.2(K)
+5В_adressLED: C65.2 C67.2 L2.2 R55.2 R59.2 VD16.2(K)
+5В_Camera: C71.1 DA2.2(OUT) R61.2 VD20.2(K)
+5В_Servo: C66.2 C68.2 L3.2 R57.2 R60.2 VD17.2(K)
GND: C55.1 C56.1 C57.1 C58.1 C59.1 C60.1 C61.1 C64.2 C65.1 C66.1 C67.1 C68.1 C69.2 C70.2 C71.2 C72.2 DA1.1(GND) DA2.1(GND) DA3.1(GND) DD8.7(GND) DD9.7(GND) R52.1 R53.1 R56.1 R58.1 VD12.1(A) VD13.2(A) VD14.2(A) VD15.1(K) VD16.1(A) VD17.1(A) VD18.1(K) VD19.1(K) VD20.1(A) VD21.1(A) VD22.1(K) VD23.1(K) X44.2
NetC59_2: C59.2 DD8.6(SS)
NetC60_2: C60.2 DD9.6(SS)
NetC62_1: C62.1 DD8.1(BOOT)
NetC62_2: C62.2 DD8.8(SW) L2.1 VD13.1(K)
NetC63_1: C63.1 DD9.1(BOOT)
NetC63_2: C63.2 DD9.8(SW) L3.1 VD14.1(K)
NetDD8_4: DD8.4(RT/SYNC) R52.2
NetDD8_5: DD8.5(FB) R55.1 R56.2
NetDD9_4: DD9.4(RT/SYNC) R53.2
NetDD9_5: DD9.5(FB) R57.1 R58.2
NetR54_1: R54.1 VD15.2(A)
NetR59_1: R59.1 VD18.2(A)
NetR60_1: R60.1 VD19.2(A)
NetR61_1: R61.1 VD22.2(A)
NetR62_1: R62.1 VD23.2(A)

Not connected (* = marked no-connect by the designer): DD8 3(EN); DD9 3(EN)

### Notes on the sheet
- Подп. и дата
- Инв. № дубл.
- Взам. инв. №
- Инв. № подл.
- Лист
- Файл:
- Изм.
- № докум.
- Подп.
- Дата
- Копировал
- Формат
- (in symbol LM1117IDTX-3.3) *STU
- (in symbol LM1117IMPX-5.0) *STU
- (in symbol XT60-M) Цепь

### Library data of the parts
C55-C58 C64-C72 = CC1210MKX5R7BB107: Конденсатор керамический 100мкФ 16В; Value: 100мк
C59 C60 = CC0603KRX7R9BB223: Конденсатор керамический 22нФ 50В; Name: CC0603KRX7R9BB223
C61 = CC0805KKX5R8BB106: Конденсатор кер. 10мкФ 25В; Value: 10 мк
C62 C63 = GRM188R71H104KA93D: as C3 on sheet RCJ_OnStage2024_FC_mcu; Name: GRM188R71H104KA93D; TKE: X7R; Value: 0,1мк
DA1 = LM1117IDTX-3.3: Линейный стабилизатор напряжения 3,3В; Manufacturer: Texas Instruments; Name: LM1117IDTX-3.3
DA2 DA3 = LM1117IMPX-5.0: Линейный стабилизатор напряжения 5В; Name: LM1117IMPX-5.0
DD8 DD9 = LMR14050: Стабилизатор напряжения 40 В 5 А; Name: LMR14050
L2 L3 = SRP1038A-220M: Катушка индуктивности 22мкГн 5А; Name: SRP1038A-220M
R52 R53 = RC0603FR-0715KL: Резистор 15кОм 0,063Вт 1%; Manufacturer: YAGEO; Name: RC0603FR-0715KL; Tolerance: 1%; Value: 15к
R54 R59 R60 = RC0805FR-07470RL: Резистор 470 0,125Вт 1%; Manufacturer: YAGEO; Name: RC0805FR-07470RL; Tolerance: 1%; Value: 470
R55 R57 = RC1206FR-0751KL: Резистор 51кОм 0.25Вт 5%; Value: 51к
R56 R58 = RC0603FR-0710KL: as R2 on sheet RCJ_OnStage2024_FC_mcu; Name: RC0603FR-0710KL; Tolerance: 1%; Value: 10к
R61 R62 = RC0805FR-07422RL: Резистор 422 0,125Вт 1%; Manufacturer: YAGEO; Name: RC0805FR-07422RL; Tolerance: 1%; Value: 422
VD12 VD16 VD17 VD20 VD21 = BZX384-C5V1: Стабилитрон 5,1В; Name: BZX384-C5V1
VD13 VD14 = SS10PH10-M3/86A: Диод Шоттки 86 А; Name: SS10PH10-M3
VD15 VD18 VD19 VD22 VD23 = LED: Светодиод
X44 = XT60-M: Разъем питания 2pin штекер; Contact_1: +4S; Contact_2: GND; Name: XT60-M

## Nets that join several sheets
+3,3В: RCJ_OnStage2024_FC_sensors (C48.2 X23.4 X23.5), RCJ_OnStage2024_FC_pwr (C64.1 DA1.2 R54.2 VD12.2)
+4S: RCJ_OnStage2024_FC_drivers (6 pins), RCJ_OnStage2024_FC_pwr (X44.1)
+4S_PROTECTED: RCJ_OnStage2024_FC_drivers (33 pins), RCJ_OnStage2024_FC_pwr (12 pins)
+5В: RCJ_OnStage2024_FC_mcu (25 pins), RCJ_OnStage2024_FC_drivers (8 pins), RCJ_OnStage2024_FC_sensors (24 pins), RCJ_OnStage2024_FC_pwr (C72.1 DA3.2 R62.2 VD21.2)
+5В_adressLED: RCJ_OnStage2024_FC_mcu (8 pins), RCJ_OnStage2024_FC_sensors (X19.2 X20.2 X21.2 X22.2), RCJ_OnStage2024_FC_pwr (6 pins)
+5В_Camera: RCJ_OnStage2024_FC_sensors (C49.2 X24.3), RCJ_OnStage2024_FC_pwr (C71.1 DA2.2 R61.2 VD20.2)
+5В_Servo: RCJ_OnStage2024_FC_drivers (9 pins), RCJ_OnStage2024_FC_pwr (6 pins)
GND: RCJ_OnStage2024_FC_mcu (55 pins), RCJ_OnStage2024_FC_drivers (68 pins), RCJ_OnStage2024_FC_sensors (32 pins), RCJ_OnStage2024_FC_pwr (38 pins)
MCU_A0: RCJ_OnStage2024_FC_mcu (DD1.89), RCJ_OnStage2024_FC_sensors (X30.1)
MCU_A1: RCJ_OnStage2024_FC_mcu (DD1.88), RCJ_OnStage2024_FC_sensors (X31.1)
MCU_A2: RCJ_OnStage2024_FC_mcu (DD1.87), RCJ_OnStage2024_FC_sensors (X32.1)
MCU_A3: RCJ_OnStage2024_FC_mcu (DD1.86), RCJ_OnStage2024_FC_sensors (X33.1)
MCU_A4: RCJ_OnStage2024_FC_mcu (DD1.85), RCJ_OnStage2024_FC_sensors (X34.1)
MCU_A5: RCJ_OnStage2024_FC_mcu (DD1.84), RCJ_OnStage2024_FC_sensors (X35.1)
MCU_A6: RCJ_OnStage2024_FC_mcu (DD1.83), RCJ_OnStage2024_FC_sensors (X36.1)
MCU_A7: RCJ_OnStage2024_FC_mcu (DD1.82), RCJ_OnStage2024_FC_sensors (X37.1)
MCU_A8: RCJ_OnStage2024_FC_mcu (DD1.97), RCJ_OnStage2024_FC_sensors (X38.1)
MCU_Bluetooth_RX: RCJ_OnStage2024_FC_mcu (DD1.46), RCJ_OnStage2024_FC_sensors (X29.2)
MCU_Bluetooth_TX: RCJ_OnStage2024_FC_mcu (DD1.45), RCJ_OnStage2024_FC_sensors (X29.1)
MCU_D1: RCJ_OnStage2024_FC_mcu (DD1.53), RCJ_OnStage2024_FC_sensors (X40.1)
MCU_D2: RCJ_OnStage2024_FC_mcu (DD1.54), RCJ_OnStage2024_FC_sensors (X41.1)
MCU_D3: RCJ_OnStage2024_FC_mcu (DD1.55), RCJ_OnStage2024_FC_sensors (X42.1)
MCU_D4: RCJ_OnStage2024_FC_mcu (DD1.56), RCJ_OnStage2024_FC_sensors (X43.1)
MCU_DRIVER1_CS: RCJ_OnStage2024_FC_mcu (DD1.96), RCJ_OnStage2024_FC_drivers (C31.2 R33.1)
MCU_DRIVER1_INA: RCJ_OnStage2024_FC_mcu (DD1.70), RCJ_OnStage2024_FC_drivers (R29.8 R31.7)
MCU_DRIVER1_INB: RCJ_OnStage2024_FC_mcu (DD1.59), RCJ_OnStage2024_FC_drivers (R29.4 R31.3)
MCU_DRIVER1_PWM: RCJ_OnStage2024_FC_mcu (DD1.23), RCJ_OnStage2024_FC_drivers (R29.6 R31.5)
MCU_DRIVER2_CS: RCJ_OnStage2024_FC_mcu (DD1.95), RCJ_OnStage2024_FC_drivers (C30.2 R32.1)
MCU_DRIVER2_INA: RCJ_OnStage2024_FC_mcu (DD1.35), RCJ_OnStage2024_FC_drivers (R28.8 R30.7)
MCU_DRIVER2_INB: RCJ_OnStage2024_FC_mcu (DD1.41), RCJ_OnStage2024_FC_drivers (R28.4 R30.3)
MCU_DRIVER2_PWM: RCJ_OnStage2024_FC_mcu (DD1.24), RCJ_OnStage2024_FC_drivers (R28.6 R30.5)
MCU_DRIVER3_CS: RCJ_OnStage2024_FC_mcu (DD1.94), RCJ_OnStage2024_FC_drivers (C42.2 R46.1)
MCU_DRIVER3_INA: RCJ_OnStage2024_FC_mcu (DD1.42), RCJ_OnStage2024_FC_drivers (R44.8 R45.7)
MCU_DRIVER3_INB: RCJ_OnStage2024_FC_mcu (DD1.50), RCJ_OnStage2024_FC_drivers (R44.4 R45.3)
MCU_DRIVER3_PWM: RCJ_OnStage2024_FC_mcu (DD1.25), RCJ_OnStage2024_FC_drivers (R44.6 R45.5)
MCU_Encoder1: RCJ_OnStage2024_FC_mcu (DD1.52), RCJ_OnStage2024_FC_drivers (X6.2)
MCU_Encoder1_int: RCJ_OnStage2024_FC_mcu (DD1.6), RCJ_OnStage2024_FC_drivers (X6.1)
MCU_Encoder2: RCJ_OnStage2024_FC_mcu (DD1.51), RCJ_OnStage2024_FC_drivers (X5.2)
MCU_Encoder2_int: RCJ_OnStage2024_FC_mcu (DD1.7), RCJ_OnStage2024_FC_drivers (X5.1)
MCU_GesturesSensor_INT: RCJ_OnStage2024_FC_mcu (DD1.57), RCJ_OnStage2024_FC_sensors (X23.1)
MCU_LED1: RCJ_OnStage2024_FC_mcu (DD1.78), RCJ_OnStage2024_FC_sensors (X19.1)
MCU_LED2: RCJ_OnStage2024_FC_mcu (DD1.77), RCJ_OnStage2024_FC_sensors (X20.1)
MCU_LED3: RCJ_OnStage2024_FC_mcu (DD1.76), RCJ_OnStage2024_FC_sensors (X21.1)
MCU_LED4: RCJ_OnStage2024_FC_mcu (DD1.75), RCJ_OnStage2024_FC_sensors (X22.1)
MCU_OpenMV_RX: RCJ_OnStage2024_FC_mcu (DD1.64), RCJ_OnStage2024_FC_sensors (X24.2)
MCU_OpenMV_TX: RCJ_OnStage2024_FC_mcu (DD1.63), RCJ_OnStage2024_FC_sensors (X24.1)
MCU_PWM0: RCJ_OnStage2024_FC_mcu (DD1.1), RCJ_OnStage2024_FC_sensors (X39.1)
MCU_Sensors_SCL: RCJ_OnStage2024_FC_mcu (DD1.43 R2.2), RCJ_OnStage2024_FC_sensors (X23.3 X28.1)
MCU_Sensors_SDA: RCJ_OnStage2024_FC_mcu (DD1.44 R3.2), RCJ_OnStage2024_FC_sensors (X23.2 X28.2)
MCU_Servo1: RCJ_OnStage2024_FC_mcu (DD1.5), RCJ_OnStage2024_FC_drivers (X9.1)
MCU_Servo2: RCJ_OnStage2024_FC_mcu (DD1.15), RCJ_OnStage2024_FC_drivers (X14.1)
MCU_Servo3: RCJ_OnStage2024_FC_mcu (DD1.16), RCJ_OnStage2024_FC_drivers (X10.1)
MCU_Servo4: RCJ_OnStage2024_FC_mcu (DD1.17), RCJ_OnStage2024_FC_drivers (X15.1)
MCU_Servo5: RCJ_OnStage2024_FC_mcu (DD1.18), RCJ_OnStage2024_FC_drivers (X11.1)
MCU_Servo6: RCJ_OnStage2024_FC_mcu (DD1.26), RCJ_OnStage2024_FC_drivers (X16.1)
MCU_Servo7: RCJ_OnStage2024_FC_mcu (DD1.38), RCJ_OnStage2024_FC_drivers (X12.1)
MCU_Servo8: RCJ_OnStage2024_FC_mcu (DD1.39), RCJ_OnStage2024_FC_drivers (X17.1)
MCU_Servo9: RCJ_OnStage2024_FC_mcu (DD1.40), RCJ_OnStage2024_FC_drivers (X13.1)
MCU_Ultrasonic1_Echo: RCJ_OnStage2024_FC_mcu (DD1.74), RCJ_OnStage2024_FC_sensors (X25.1)
MCU_Ultrasonic1_Trig: RCJ_OnStage2024_FC_mcu (DD1.73), RCJ_OnStage2024_FC_sensors (X25.2)
MCU_Ultrasonic2_Echo: RCJ_OnStage2024_FC_mcu (DD1.72), RCJ_OnStage2024_FC_sensors (X26.1)
MCU_Ultrasonic2_Trig: RCJ_OnStage2024_FC_mcu (DD1.71), RCJ_OnStage2024_FC_sensors (X26.2)
MCU_Ultrasonic3_Echo: RCJ_OnStage2024_FC_mcu (DD1.36), RCJ_OnStage2024_FC_sensors (X27.1)
MCU_Ultrasonic3_Trig: RCJ_OnStage2024_FC_mcu (DD1.37), RCJ_OnStage2024_FC_sensors (X27.2)